# Altium project IndicatorBox.PrjPCB
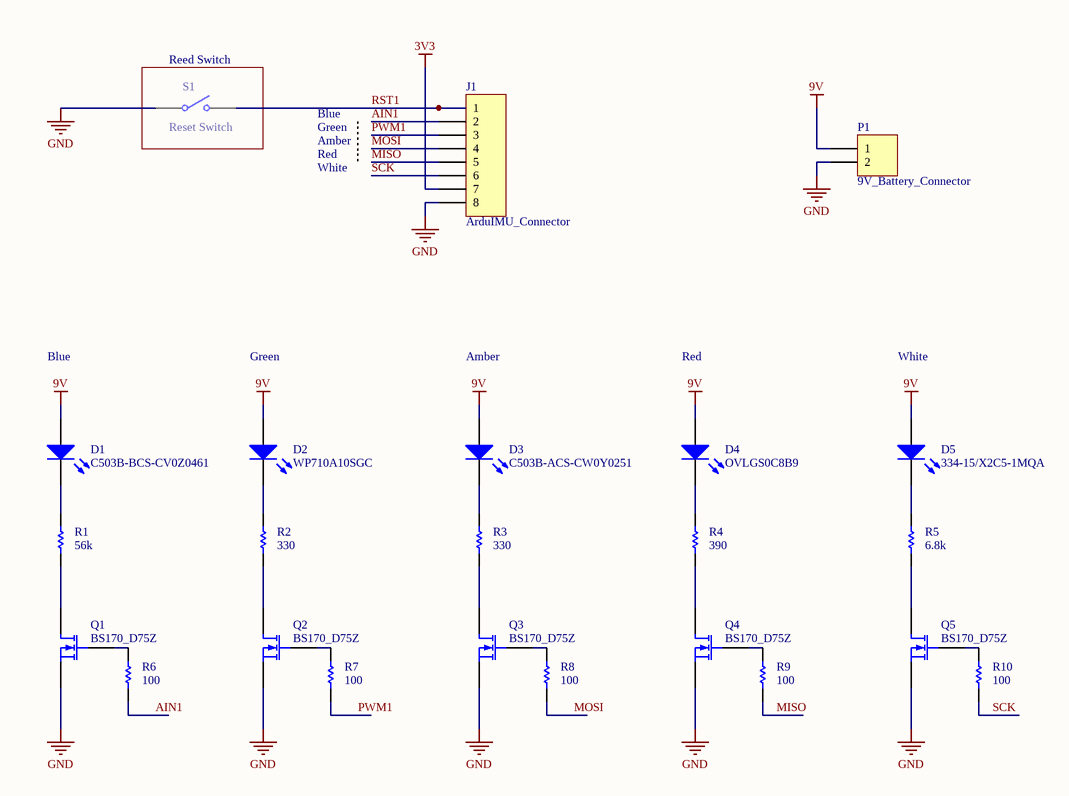
[diagram p0: IndicatorBox.SchDoc]
1 sheet, 23 parts. Net scope: global (net labels, ports and power ports of the same name join across sheets).

## Sheet IndicatorBox.SchDoc: Demonstration System Indicator Box
size A4; DrawnBy: J.F.B; Revision: 3; SheetNumber: 1; SheetTotal: 1

### Parts
D1  C503B-BCS-CV0Z0461  [LED-0]
D2  WP710A10SGC  [LED-0]
D3  C503B-ACS-CW0Y0251  [LED-0]
D4  OVLGS0C8B9  [LED-0]
D5  334-15/X2C5-1MQA  [LED-0]
J1  ArduIMU_Connector  [HDR1X8]
P1  9V_Battery_Connector  [HDR1X2]
Q1  BS170_D75Z  [E3]
Q2  BS170_D75Z  [E3]
Q3  BS170_D75Z  [E3]
Q4  BS170_D75Z  [E3]
Q5  BS170_D75Z  [E3]
R1  value 56k  [AXIAL-0.3]
R2  value 330  [AXIAL-0.3]
R3  value 330  [AXIAL-0.3]
R4  value 390  [AXIAL-0.3]
R5  value 6.8k  [AXIAL-0.3]
R6  value 100  [AXIAL-0.3]
R7  value 100  [AXIAL-0.3]
R8  value 100  [AXIAL-0.3]
R9  value 100  [AXIAL-0.3]
R10  value 100  [AXIAL-0.3]
S1  Reset Switch  [SPST-2]

### Blocks framed on the sheet
Reed Switch: S1

### Nets
3V3: J1.7
9V: D1.1(A) D2.1(A) D3.1(A) D4.1(A) D5.1(A) P1.1
GND: J1.8 P1.2 Q1.3(S) Q2.3(S) Q3.3(S) Q4.3(S) Q5.3(S) S1.1(COMMON)
AIN1: J1.2 R6.1
MISO: J1.5 R9.1
MOSI: J1.4 R8.1
PWM1: J1.3 R7.1
RST1: J1.1 S1.2(NO)
SCK: J1.6 R10.1
NetD1_2: D1.2(K) R1.2
NetD2_2: D2.2(K) R2.2
NetD3_2: D3.2(K) R3.2
NetD4_2: D4.2(K) R4.2
NetD5_2: D5.2(K) R5.2
NetQ1_1: Q1.1(D) R1.1
NetQ1_2: Q1.2(G) R6.2
NetQ2_1: Q2.1(D) R2.1
NetQ2_2: Q2.2(G) R7.2
NetQ3_1: Q3.1(D) R3.1
NetQ3_2: Q3.2(G) R8.2
NetQ4_1: Q4.1(D) R4.1
NetQ4_2: Q4.2(G) R9.2
NetQ5_1: Q5.1(D) R5.1
NetQ5_2: Q5.2(G) R10.2

### Notes on the sheet
- Blue
- Green
- Amber
- Red
- White

### Library data of the parts
D1-D5 = LED0: Typical INFRARED GaAs LED; Published: 8-Jun-2000; LatestRevisionDate: 08-Jul-2005; LatestRevisionNote: Mech Layer 1 removed.; PackageReference: LED-0; Publisher: Altium Limited; PackageDescription: LED; 2 Leads
J1 = Header 8: Header, 8-Pin; LatestRevisionDate: 17-Jul-2002; LatestRevisionNote: Re-released for DXP Platform.; Publisher: Altium Limited
P1 = Header 2: Header, 2-Pin; LatestRevisionDate: 17-Jul-2002; LatestRevisionNote: Re-released for DXP Platform.; Publisher: Altium Limited
Q1-Q5 = MOSFET-N: N-Channel MOSFET; Published: 8-Jun-2000; LatestRevisionDate: 17-Jul-2002; LatestRevisionNote: Re-released for DXP Platform.; PackageVersion: 1995/1996; PackageReference: E3; Publisher: Altium Limited; PackageDescription: TO, Flat Index; 3 In-Line, Axial Leads; Body Dia. 4.6mm; Lead Dia. 0.5 mm (max)
R1-R10 = Res1: Resistor; Published: 8-Jun-2000; LatestRevisionDate: 17-Jul-2002; LatestRevisionNote: Re-released for DXP Platform.; PackageReference: AXIAL-0.3; Publisher: Altium Limited; PackageDescription: Axial Device, Thru-Hole; 2 Leads; 0.3 in Pin Spacing
S1 = SW-SPST: Single-Pole, Single-Throw Switch; Published: 24-Mar-1999; LatestRevisionDate: 17-Jul-2002; LatestRevisionNote: Re-released for DXP Platform.; PackageReference: SPST-2; Publisher: Altium Limited; PackageDescription: Switch; 2 Leads